# Altium schematic sheet DC-DC_24V_To_5V0.SchDoc: =DocumentName
size A4; CompanyName: "AS Manufacturing" LLC; Organization: "AS Manufacturing" LLC; Address1: 5 Sklyarenka St.; Address2: Kyiv 04073; Address3: Ukraine; Address4: https://ajax.systems/en/; DocumentNumber: 8; SheetNumber: 3; SheetTotal: 6; Template_version: 1.0.1
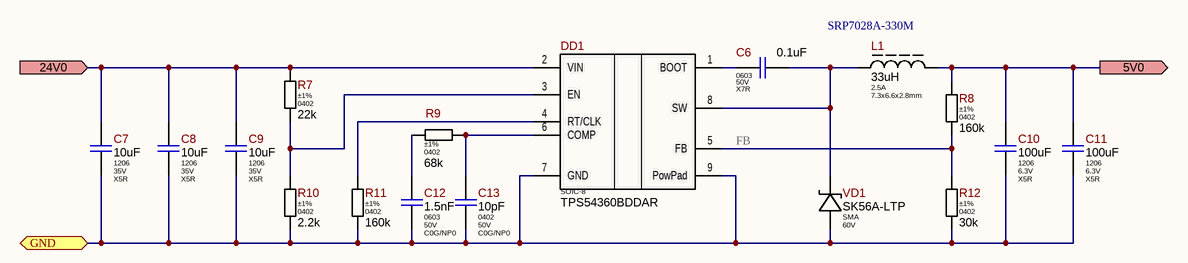
[diagram p0: DC-DC_24V_To_5V0.SchDoc]

## Parts
C6  Package: 0603  Voltage: 50V  Dielectric Type: X7R  [C_CERAMIC_0603_MED]  (hidden comment: 0.1uF)
C7  Package: 1206  Voltage: 35V  Dielectric Type: X5R  [CAP-1206(3216)X85T15]  (hidden comment: 10uF)
C8  Package: 1206  Voltage: 35V  Dielectric Type: X5R  [CAP-1206(3216)X85T15]  (hidden comment: 10uF)
C9  Package: 1206  Voltage: 35V  Dielectric Type: X5R  [CAP-1206(3216)X85T15]  (hidden comment: 10uF)
C10  Package: 1206  Voltage: 6.3V  Dielectric Type: X5R  [C_CERAMIC_1206_MED]  (hidden comment: 100uF)
C11  Package: 1206  Voltage: 6.3V  Dielectric Type: X5R  [C_CERAMIC_1206_MED]  (hidden comment: 100uF)
C12  Package: 0603  Voltage: 50V  Dielectric Type: C0G/NP0  [C_CERAMIC_0603_MED]  (hidden comment: 1.5nF)
C13  Package: 0402  Voltage: 50V  Dielectric Type: C0G/NP0  [C_CERAMIC_0402_MED]  (hidden comment: 10pF)
DD1  Package: SOIC-8  [SOIC127P620X170_HS-9N]  (hidden comment: TPS54360BDDAR)
L1  Current: 2.5A  Package: 7.3x6.6x2.8mm  Part Number: SRP7028A-330M  [SRP7028A-Series]  (hidden comment: 33uH)
R7  Tolerance: ±1%  Package: 0402  [R_ANY_CHIP_0402_MED]  (hidden comment: 22k)
R8  Tolerance: ±1%  Package: 0402  [R_ANY_CHIP_0402_MED]  (hidden comment: 160k)
R9  Tolerance: ±1%  Package: 0402  [R_ANY_CHIP_0402_MED]  (hidden comment: 68k)
R10  Tolerance: ±1%  Package: 0402  [R_ANY_CHIP_0402_MED]  (hidden comment: 2.2k)
R11  Tolerance: ±1%  Package: 0402  [R_ANY_CHIP_0402_MED]  (hidden comment: 160k)
R12  Tolerance: ±1%  Package: 0402  [R_ANY_CHIP_0402_MED]  (hidden comment: 30k)
VD1  Package: SMA  Voltage: 60V  [SMA_MED]  (hidden comment: SK56A-LTP)

## Ports
5V0 (out, see UI[1C], DC-DC_5V0_To_3V3[2B], Display_4DLCD-35480320-IPS[2C]), 24V0 (in, see UI[1C]), GND (bidir, see UI[1C], DC-DC_5V0_To_3V3[2C], Display_4DLCD-35480320-IPS[2A], Display_4DLCD-35480320-IPS[2B], Display_4DLCD-35480320-IPS[2D], MCU_STM32L010K4T6[3B], MCU_STM32L010K4T6[4B])

## Nets
5V0: C10.1 C11.1 L1.2 R8.1 ; port 5V0
24V0: C7.1 C8.1 C9.1 DD1.2(VIN) R7.1 ; port 24V0
FB: DD1.5(FB) R8.2 R12.1
GND: C7.2 C8.2 C9.2 C10.2 C11.2 C12.1 C13.2 DD1.7(GND) DD1.9(PowPad) R10.2 R11.2 R12.2 VD1.AN ; port GND
NetC6_1: C6.1 DD1.1(BOOT)
NetC6_2: C6.2 DD1.8(SW) L1.1 VD1.CA
NetC12_2: C12.2 R9.2
NetC13_1: C13.1 DD1.6(COMP) R9.1
NetDD1_3: DD1.3(EN) R7.2 R10.1
NetDD1_4: DD1.4(RT/CLK) R11.1

## Notes on the sheet
- Title
- Product:
- Project:
- Size:
- Date:
- Variant:
- A4
- Authors:
- Time:
- Sheet
- of
- Rev:
- Commit:

## Library data of the parts
C6 = Capacitor-NonPolar: 100nF 50V X7R ±10% 0603 Ceramic Capacitor RoHS; Part Number: CL10B104KB8NNNC; Manufacturer: Samsung Electro-Mechanics; Standard Lead Time: 18 Weeks; Replacement: CL10B104KB8NNND; Component Status: Released; Value: 0.1uF; Part Type: Ceramic / X7R / 0603; Component Type: SMD; Temperature Range: -55°C ~ 125°C; Tolerance: ±10%; ComponentLink1URL: https://media.digikey.com/pdf/Data%20Sheets/Samsung%20PDFs/CL_Series_MLCC_ds.pdf; Supplier 1: Digi-Key; Supplier Part Number 1: 1276-1000-2-ND; ComponentLink1Description: Datasheet; Price: 0.00273
C7-C9 = Capacitor-NonPolar: 10uF 35V X5R ±10% 1206 Ceramic Capacitor RoHS; Part Number: GRM319R6YA106KA12D; Manufacturer: Murata Electronics; Standard Lead Time: NONE; Component Status: Released; Value: 10uF; Part Type: Ceramic / X5R / 1206; Component Type: SMD; Temperature Range: -55°C ~ 85°C; Tolerance: ±10%; ComponentLink1URL: https://search.murata.co.jp/Ceramy/image/img/A01X/G101/ENG/GRM319R6YA106KA12-01.pdf; Supplier 1: Digi-Key; Supplier Part Number 1: 490-9964-1-ND; Replacement: NONE; ComponentLink1Description: Datasheet; Price: 0.03648
C10 C11 = Capacitor-NonPolar: 100uF 6.3V X5R ±20% 1206 Ceramic Capacitor RoHS; Part Number: CL31A107MQHNNNE; Manufacturer: Samsung Electro-Mechanics; Standard Lead Time: 22 Weeks; Replacement: NONE; Component Status: Released; Value: 100uF; Part Type: Ceramic / X5R / 1206; Component Type: SMD; Temperature Range: -55°C ~ 85°C; Tolerance: ±20%; ComponentLink1URL: https://media.digikey.com/pdf/Data%20Sheets/Samsung%20PDFs/CL_Series_MLCC_ds.pdf; Supplier 1: Digi-Key; Supplier Part Number 1: 1276-1782-2-ND; ComponentLink1Description: Datasheet; Price: 0,05600243
C12 = Capacitor-NonPolar: 1.5nF 50V C0G(NP0) ±5% 0603 Ceramic Capacitor RoHS; Part Number: GRM1885C1H152JA01D; Manufacturer: Murata Electronics; Standard Lead Time: 22 Weeks; Component Status: Released; Replacement: NONE; Value: 1.5nF; Part Type: Ceramic / C0G(NP0) / 0603; Component Type: SMD; Temperature Range: -55°C ~ 125°C; Tolerance: ±5%; ComponentLink1URL: https://eu.mouser.com/datasheet/2/281/1/GRM1885C1H152JA01_01A-1984714.pdf; Supplier 1: Mouser; Supplier Part Number 1: 81-GRM1885C1H152JA01; Price: 0.00446; ComponentLink1Description: Datasheet
C13 = Capacitor-NonPolar: 10pF 50V C0G ±5% 0402 Ceramic Capacitor RoHS; Part Number: CL05C100JB5NNNC; Manufacturer: Samsung Electro-Mechanics; Standard Lead Time: 28 Weeks; Replacement: NONE; Component Status: Released; Value: 10pF; Part Type: Ceramic / C0G(NP0) / 0402; Component Type: SMD; Temperature Range: -55°C ~ 125°C; Tolerance: ±5%; ComponentLink1URL: https://media.digikey.com/pdf/Data%20Sheets/Samsung%20PDFs/CL_Series_MLCC_ds.pdf; Supplier 1: Digi-Key; Supplier Part Number 1: 1276-1139-2-ND; ComponentLink1Description: Datasheet; Price: 0.00145
DD1 = TPS54360B: 60V Input, 3.5A, Step-Down DC/DC Converter With Eco-Mode, SOIC-8 EP; Manufacturer: Texas Instruments; Standard Lead Time: 16 Weeks; Replacement: NONE; Component Status: Released; Part Number: TPS54360BDDAR; Part Type: Power / DC-DC / Buck; Component Type: SMD; Temperature Range: -40°C ~ 150°C; ComponentLink1URL: https://www.ti.com/lit/ds/symlink/tps54360b.pdf; Supplier 1: Digi-Key; Supplier Part Number 1: 296-TPS54360BDDARTR-ND; ComponentLink1Description: Datasheet; Price: 5,11
L1 = Inductor-Ferrite-Fixed: 33uH Shielded Wirewound Power Inductor 2.5A 240mOhm Max; Manufacturer: Bourns Inc; Tolerance: ±20%; Component Status: Released; Standard Lead Time: 24 Weeks; Replacement: NONE; Value: 33uH; Part Type: Power / Ferrite Core; Saturation Current: 2.5A; Component Type: SMD; Temperature Range: -40°C ~ 150°C; ComponentLink1URL: https://eu.mouser.com/datasheet/2/54/srp7028a-1391359.pdf; Supplier 1: Mouser; Supplier Part Number 1: 652-SRP7028A-330M; Price: 0.807; ComponentLink1Description: Datasheet
R7 = Resistor: 22 kOhms ±1% 1/16W 0402 Thick Film Resistor; Part Number: RC0402FR-0722KL; Manufacturer: Yageo; Power Rating: 0.062W; Voltage: 50V; Temperature Stability: ±100ppm/°C; Replacement: NONE; Component Status: Released; Value: 22k; Component Type: SMD; Temperature Range: -55°C ~ 155°C; ComponentLink1URL: https://eu.mouser.com/datasheet/2/447/PYu_RC_Group_51_RoHS_L_10-1664068.pdf; ComponentLink1Description: Datasheet; Part Type: Thick Film; Price: 0,00065038
R8 R11 = Resistor: 160 kOhms ±1% 1/16W 0402 Thick Film Resistor; Part Number: RC0402FR-07160KL; Manufacturer: Yageo; Power Rating: 0.062W; Voltage: 50V; Temperature Stability: ±100ppm/°C; Replacement: NONE; Component Status: Released; Value: 160k; Component Type: SMD; Temperature Range: -55°C ~ 155°C; ComponentLink1URL: https://eu.mouser.com/datasheet/2/447/PYu_RC_Group_51_RoHS_L_11-1984063.pdf; ComponentLink1Description: Datasheet; Part Type: Thick Film; Price: 0,0005
R9 = Resistor: 68 kOhms ±1% 1/16W 0402 Thick Film Resistor; Part Number: RC0402FR-0768KL; Manufacturer: Yageo; Power Rating: 0.062W; Voltage: 50V; Temperature Stability: ±100ppm/°C; Replacement: NONE; Component Status: Released; Value: 68k; Component Type: SMD; Temperature Range: -55°C ~ 155°C; ComponentLink1URL: https://eu.mouser.com/datasheet/2/447/PYu_RC_Group_51_RoHS_L_11-1984063.pdf; Supplier 1: Digi-Key; Supplier Part Number 1: 311-68.0KLRTR-ND; ComponentLink1Description: Datasheet; Part Type: Thick Film; Price: 0,00065051
R10 = Resistor: 2.2 kOhms ±1% 1/16W 0402 Thick Film Resistor; Part Number: RC0402FR-072K2L; Manufacturer: Yageo; Power Rating: 0.062W; Voltage: 50V; Temperature Stability: ±100ppm/°C; Replacement: NONE; Component Status: Released; Value: 2.2k; Component Type: SMD; Temperature Range: -55°C ~ 155°C; ComponentLink1URL: https://eu.mouser.com/datasheet/2/447/PYu_RC_Group_51_RoHS_L_11-1984063.pdf; ComponentLink1Description: Datasheet; Part Type: Thick Film; Price: 0,00065
R12 = Resistor: 30 kOhms ±1% 1/16W 0402 Thick Film Resistor; Part Number: RC0402FR-0730KL; Manufacturer: Yageo; Power Rating: 0.062W; Voltage: 50V; Temperature Stability: ±100ppm/°C; Replacement: NONE; Component Status: Released; Value: 30k; Component Type: SMD; Temperature Range: -55°C ~ 155°C; ComponentLink1URL: https://eu.mouser.com/datasheet/2/447/PYu_RC_Group_51_RoHS_L_11-1984063.pdf; Supplier 1: Digi-Key; Supplier Part Number 1: 311-30.0KLRTR-ND; ComponentLink1Description: Datasheet; Part Type: Thick Film; Price: 0,00065
VD1 = Diode-Schottky: Diode Schottky 60V 5A, SMA; Manufacturer: Micro Commercial Components; Marking: SK56A; Standard Lead Time: 12 Weeks; Vf: 750mV @ 5A; Replacement: NONE; Component Status: Released; Part Number: SK56A-LTP; Part Type: Schottky; Component Type: SMD; Current: 5A; Temperature Range: -55°C ~ 150°C; ComponentLink1URL: \\altiumdb.ajax.local\files\Datasheet\Diodes\SK52A-L-SK510A-L(DO-214AC).pdf; Supplier 1: Digi-Key; Supplier Part Number 1: SK56A-LTPMSTR-ND; ComponentLink1Description: Datasheet; Price: 0.06